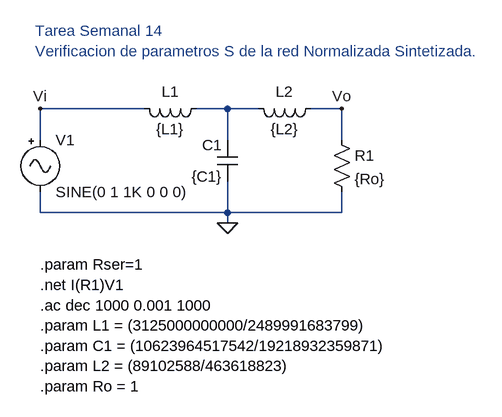
[diagram p0: schematic normalizado.asc]
normalizado.asc, the LTspice schematic file:
Version 4
SHEET 1 880 680
WIRE 192 240 32 240
WIRE 320 240 272 240
WIRE 368 240 320 240
WIRE 496 240 448 240
WIRE 32 288 32 240
WIRE 320 288 320 240
WIRE 496 288 496 240
WIRE 32 400 32 368
WIRE 320 400 320 352
WIRE 320 400 32 400
WIRE 496 400 496 368
WIRE 496 400 320 400
WIRE 320 416 320 400
FLAG 320 416 0
FLAG 496 240 Vo
FLAG 32 240 Vi
SYMBOL res 480 272 R0
SYMATTR InstName R1
SYMATTR Value {Ro}
SYMBOL ind 288 224 R90
WINDOW 0 5 56 VBottom 2
WINDOW 3 32 56 VTop 2
SYMATTR InstName L1
SYMATTR Value {L1}
SYMBOL ind 464 224 R90
WINDOW 0 5 56 VBottom 2
WINDOW 3 32 56 VTop 2
SYMATTR InstName L2
SYMATTR Value {L2}
SYMBOL cap 336 352 R180
WINDOW 0 24 56 Left 2
WINDOW 3 24 8 Left 2
SYMATTR InstName C1
SYMATTR Value {C1}
SYMBOL Misc/signal 32 272 R0
SYMATTR InstName V1
SYMATTR Value SINE(0 1 1K 0 0 0)
SYMATTR Value2 AC 1
SYMATTR SpiceLine Rser={Rser}
TEXT 32 480 Left 2 !.param Rser=1\n.net I(R1)V1\n.ac dec 1000 0.001 1000\n.param L1 = (3125000000000/2489991683799)\n.param C1 = (10623964517542/19218932359871)\n.param L2 = (89102588/463618823)\n.param Ro = 1
TEXT 24 120 Left 2 ;Tarea Semanal 14\nVerificacion de parametros S de la red Normalizada Sintetizada.

The netlist it stands for:
* normalizado.asc
R1 Vo 0 {Ro}
L1 N001 Vi {L1}
L2 Vo N001 {L2}
C1 0 N001 {C1}
V1 Vi 0 SINE(0 1 1K 0 0 0) AC 1 Rser={Rser}
.param Rser=1
.net I(R1)V1
.ac dec 1000 0.001 1000
.param L1 = (3125000000000/2489991683799)
.param C1 = (10623964517542/19218932359871)
.param L2 = (89102588/463618823)
.param Ro = 1
* Tarea Semanal 14
* Verificacion de parametros S de la red Normalizada Sintetizada.
.backanno
.end